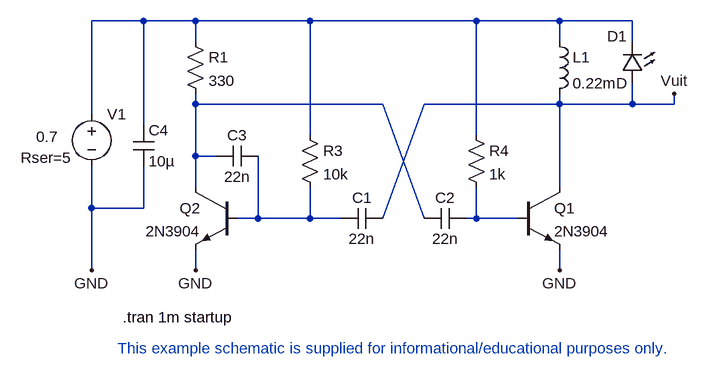
[diagram p0: schematic zaklamp.asc]
zaklamp.asc, the LTspice schematic file:
Version 4
SHEET 1 888 1240
WIRE -656 976 -656 928
WIRE -656 848 -368 848
WIRE -304 848 -96 848
WIRE -96 848 -96 976
WIRE -480 976 -480 1024
WIRE -480 1024 -560 1024
WIRE -224 976 -224 1024
WIRE -224 1024 -160 1024
WIRE -432 1024 -480 1024
WIRE -240 1024 -224 1024
WIRE -368 1024 -304 848
WIRE -304 1024 -368 848
WIRE -656 1072 -656 1104
WIRE -96 1072 -96 1104
WIRE -816 1104 -816 1008
WIRE -816 864 -816 720
WIRE -816 720 -736 720
WIRE -656 720 -480 720
WIRE -96 720 -96 752
WIRE -96 832 -96 848
WIRE -96 720 16 720
WIRE 16 720 16 752
WIRE -96 848 16 848
WIRE 16 848 16 816
WIRE -480 896 -480 720
WIRE -480 720 -224 720
WIRE -224 896 -224 720
WIRE -224 720 -96 720
WIRE -656 752 -656 720
WIRE -560 928 -560 1024
WIRE -560 1024 -592 1024
WIRE -624 928 -656 928
WIRE -656 928 -656 848
WIRE -656 848 -656 832
WIRE -736 880 -736 720
WIRE -736 720 -656 720
WIRE -736 944 -736 1008
WIRE -736 1008 -816 1008
WIRE -816 1008 -816 944
WIRE 16 848 80 848
WIRE 80 848 80 832
FLAG -96 1104 GND
FLAG -656 1104 GND
FLAG -816 1104 GND
FLAG 80 832 Vuit
SYMBOL RES -672 736 R0
SYMATTR InstName R1
SYMATTR Value 330
SYMBOL res -496 880 R0
SYMATTR InstName R3
SYMATTR Value 10k
SYMBOL res -240 880 R0
SYMATTR InstName R4
SYMATTR Value 1k
SYMBOL cap -368 1008 R90
WINDOW 0 0 32 VBottom 0
WINDOW 3 32 32 VTop 0
SYMATTR InstName C1
SYMATTR Value 22n
SYMBOL cap -240 1008 R90
WINDOW 0 0 32 VBottom 0
WINDOW 3 32 32 VTop 0
SYMATTR InstName C2
SYMATTR Value 22n
SYMBOL VOLTAGE -816 848 R0
WINDOW 3 -85 50 Left 0
WINDOW 123 0 0 Left 0
WINDOW 39 -109 83 Left 0
SYMATTR InstName V1
SYMATTR Value 0.7
SYMATTR SpiceLine Rser=5
SYMBOL NPN -160 976 R0
SYMATTR InstName Q1
SYMATTR Value 2N3904
SYMBOL npn -592 976 M0
SYMATTR InstName Q2
SYMATTR Value 2N3904
SYMBOL ind -112 736 R0
SYMATTR InstName L1
SYMATTR Value 0.22m
SYMBOL cap -560 912 R90
WINDOW 0 0 32 VBottom 0
WINDOW 3 32 32 VTop 0
SYMATTR InstName C3
SYMATTR Value 22n
SYMBOL LED 32 816 R180
WINDOW 0 24 72 Left 0
WINDOW 3 24 0 Left 0
SYMATTR InstName D1
SYMBOL cap -752 880 R0
SYMATTR InstName C4
SYMATTR Value 10µ
TEXT -768 1176 Left 0 !.tran 1m startup
TEXT -776 1224 Left 0 ;This example schematic is supplied for informational/educational purposes only.

The netlist it stands for:
* zaklamp.asc
R1 N004 N001 330
R3 N004 N002 10k
R4 N004 N003 1k
C1 Vuit N002 22n
C2 N003 N001 22n
V1 N004 GND 0.7 Rser=5
Q1 Vuit N003 GND 0 2N3904
Q2 N001 N002 GND 0 2N3904
L1 N004 Vuit 0.22m
C3 N002 N001 22n
D1 Vuit N004 D
C4 N004 GND 10µ
.model D D
.lib standard.dio
.model NPN NPN
.model PNP PNP
.lib standard.bjt
.tran 1m startup
* This example schematic is supplied for informational/educational purposes only.
.backanno
.end